# EAGLE schematic skematik jppi (EAGLE 9.6.2)
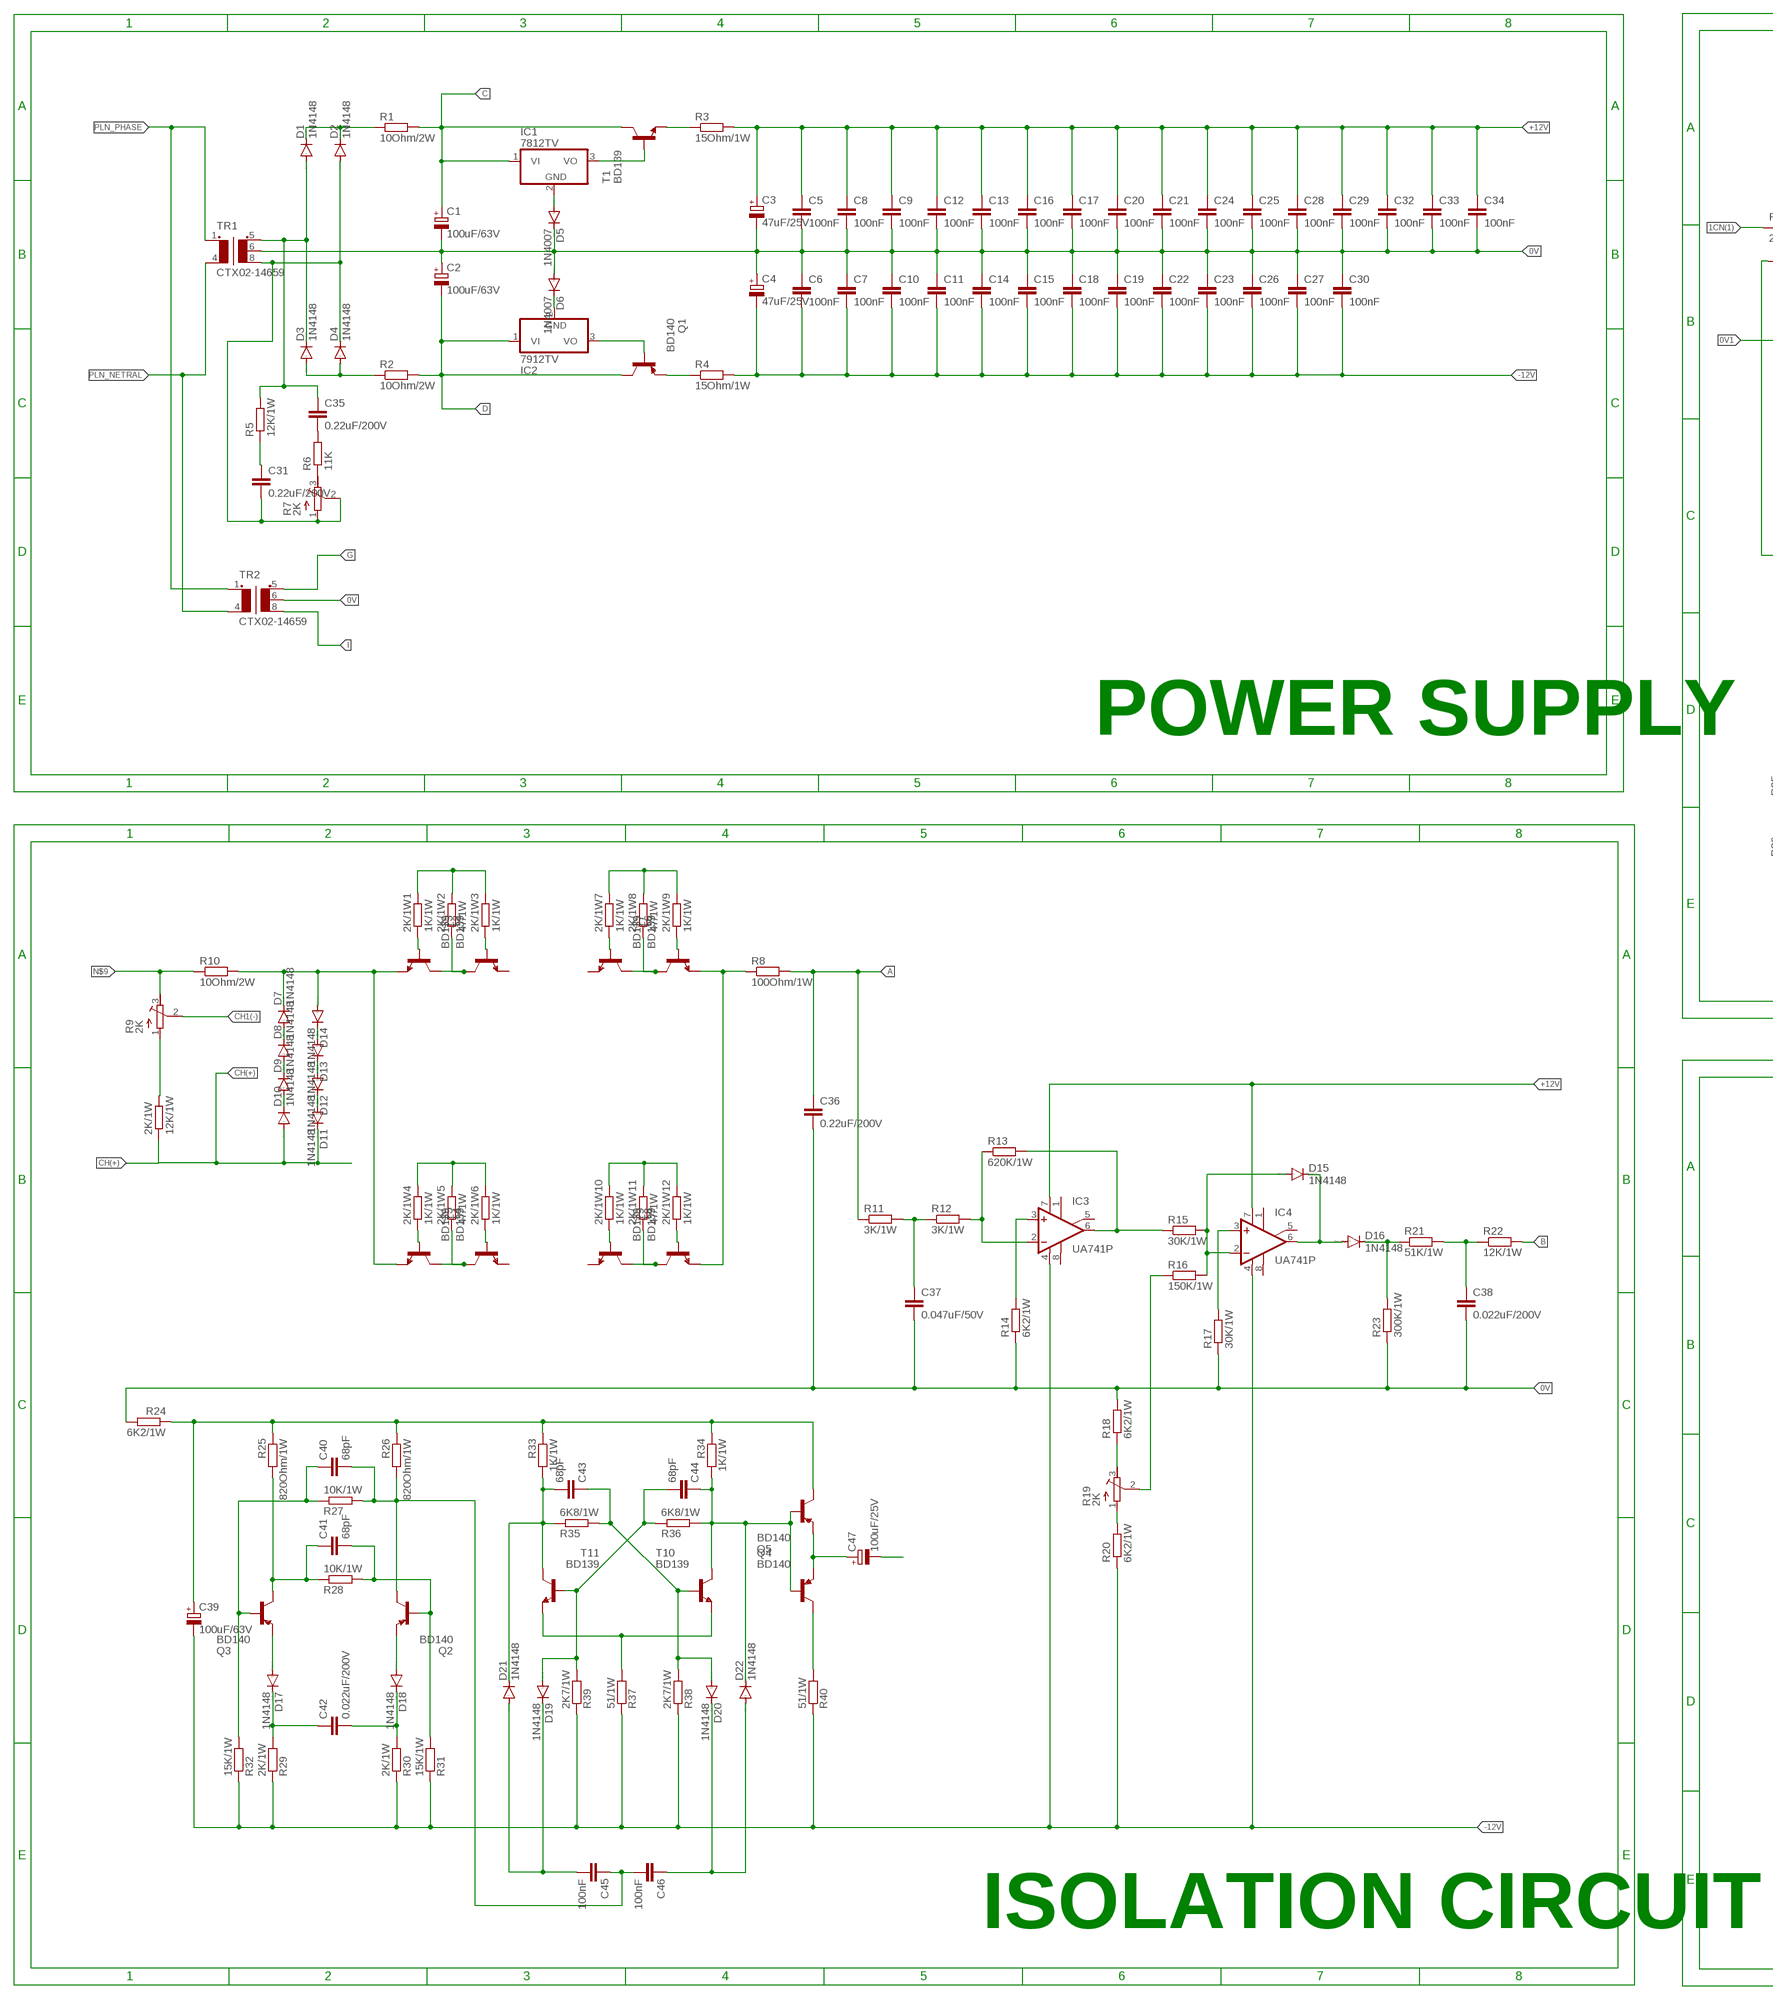
[diagram p0: schematic, sheet 1, part 1 of 3]
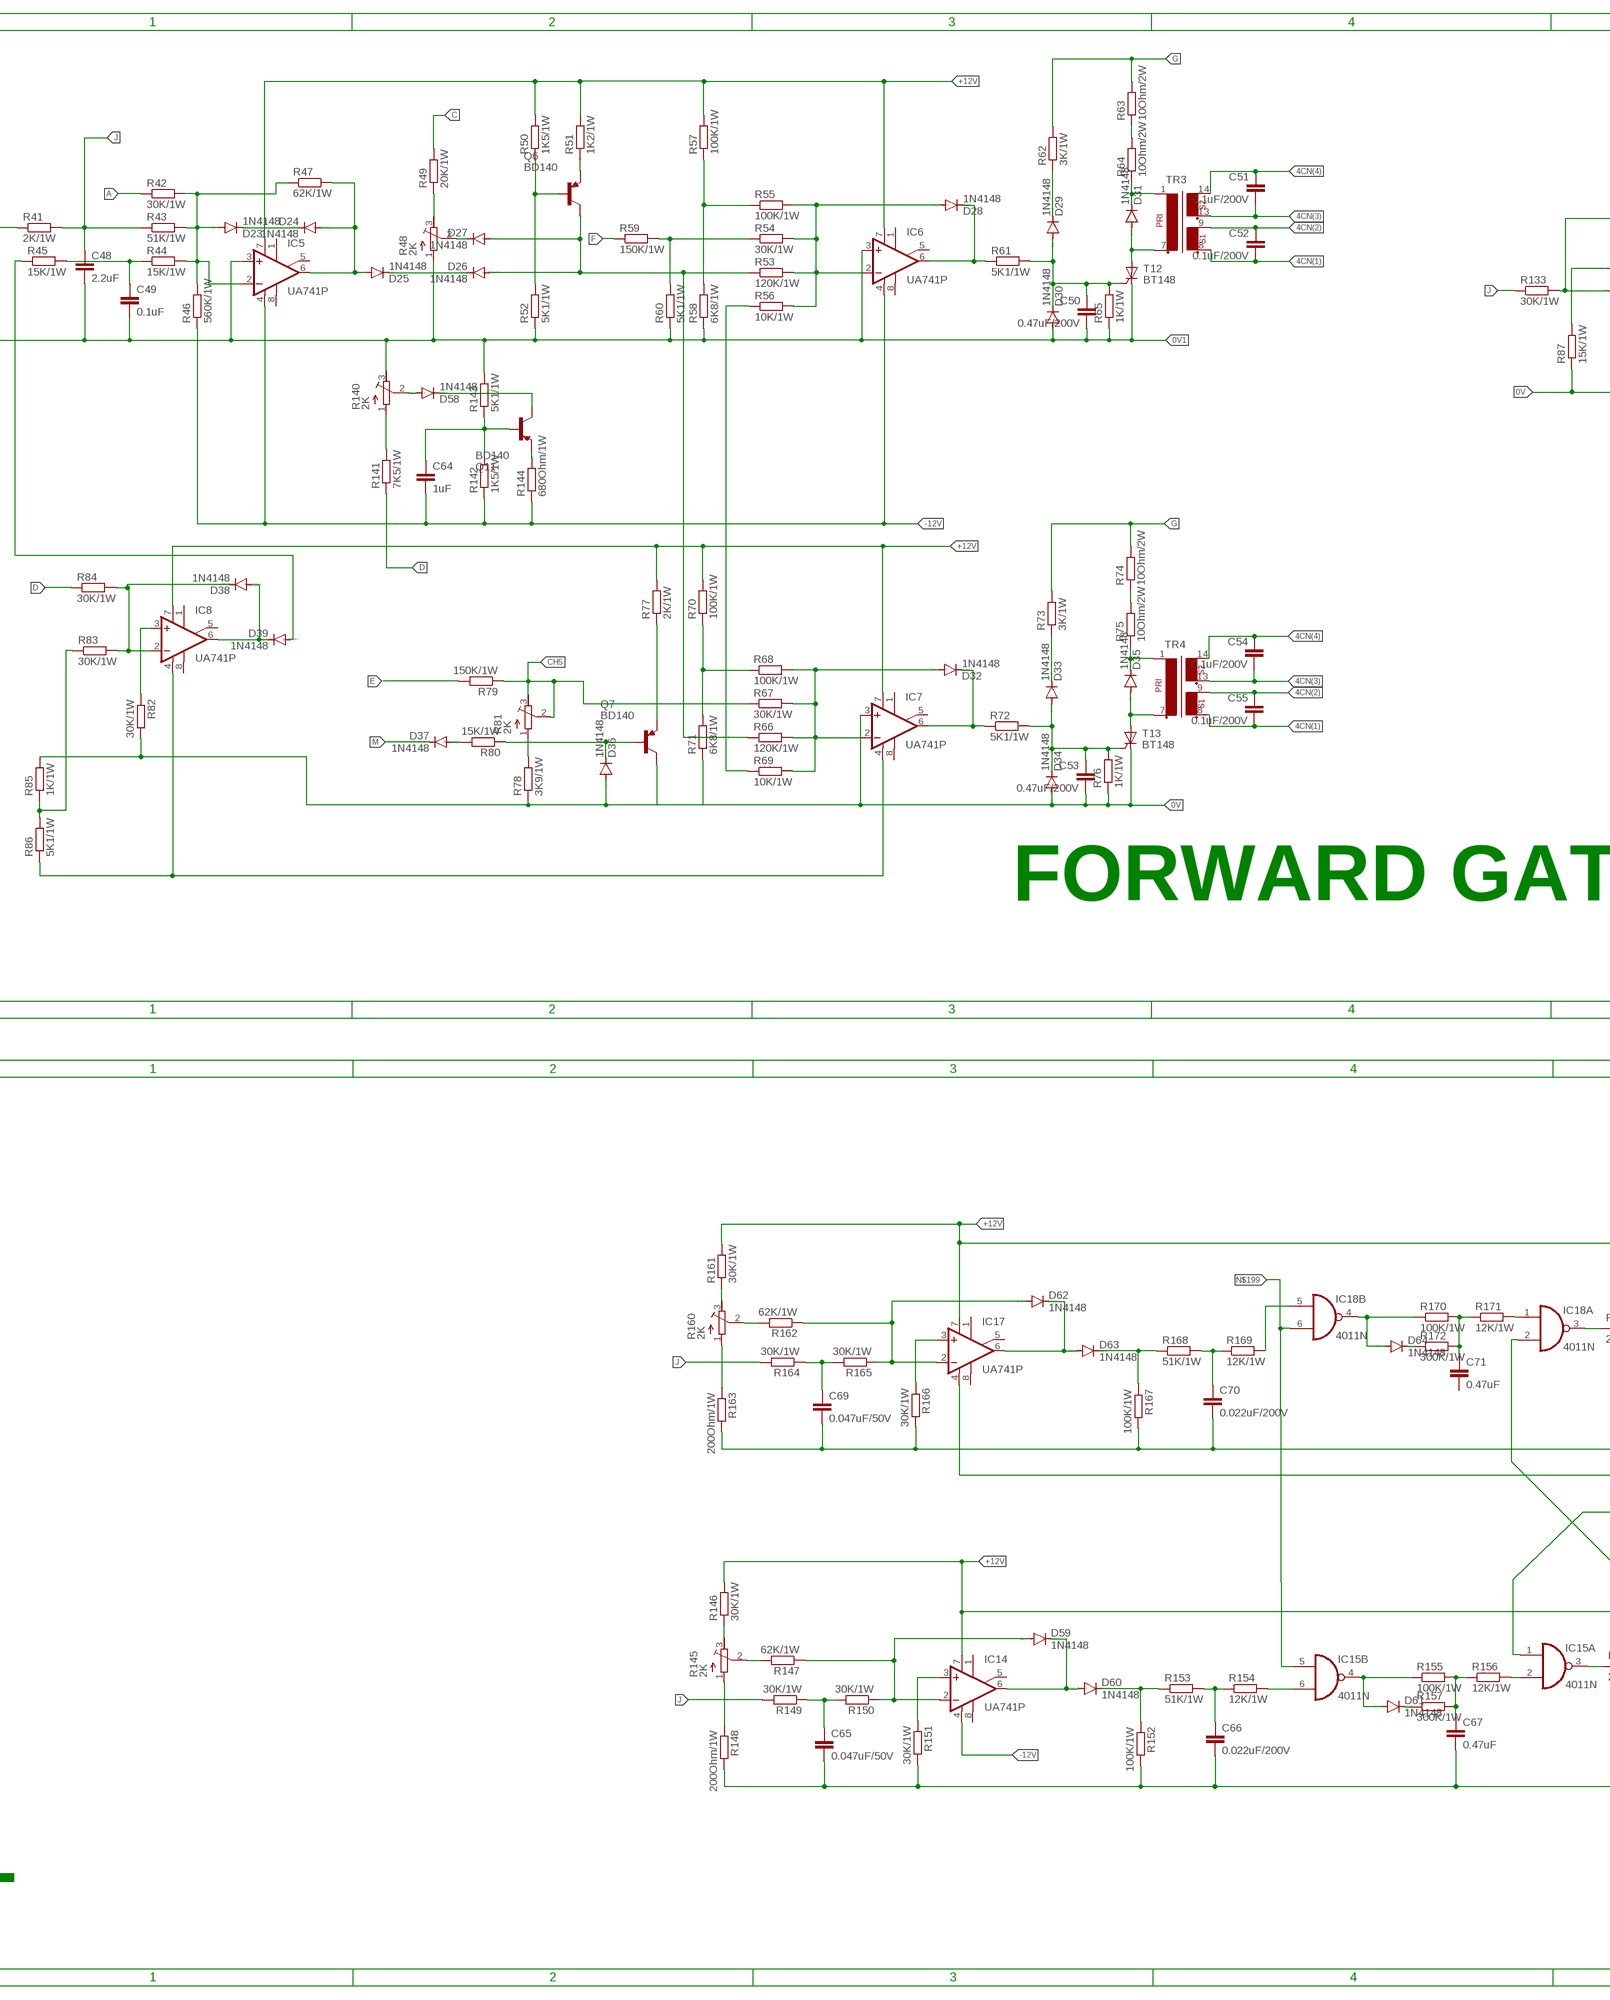
[diagram p1: schematic, sheet 1, part 2 of 3]
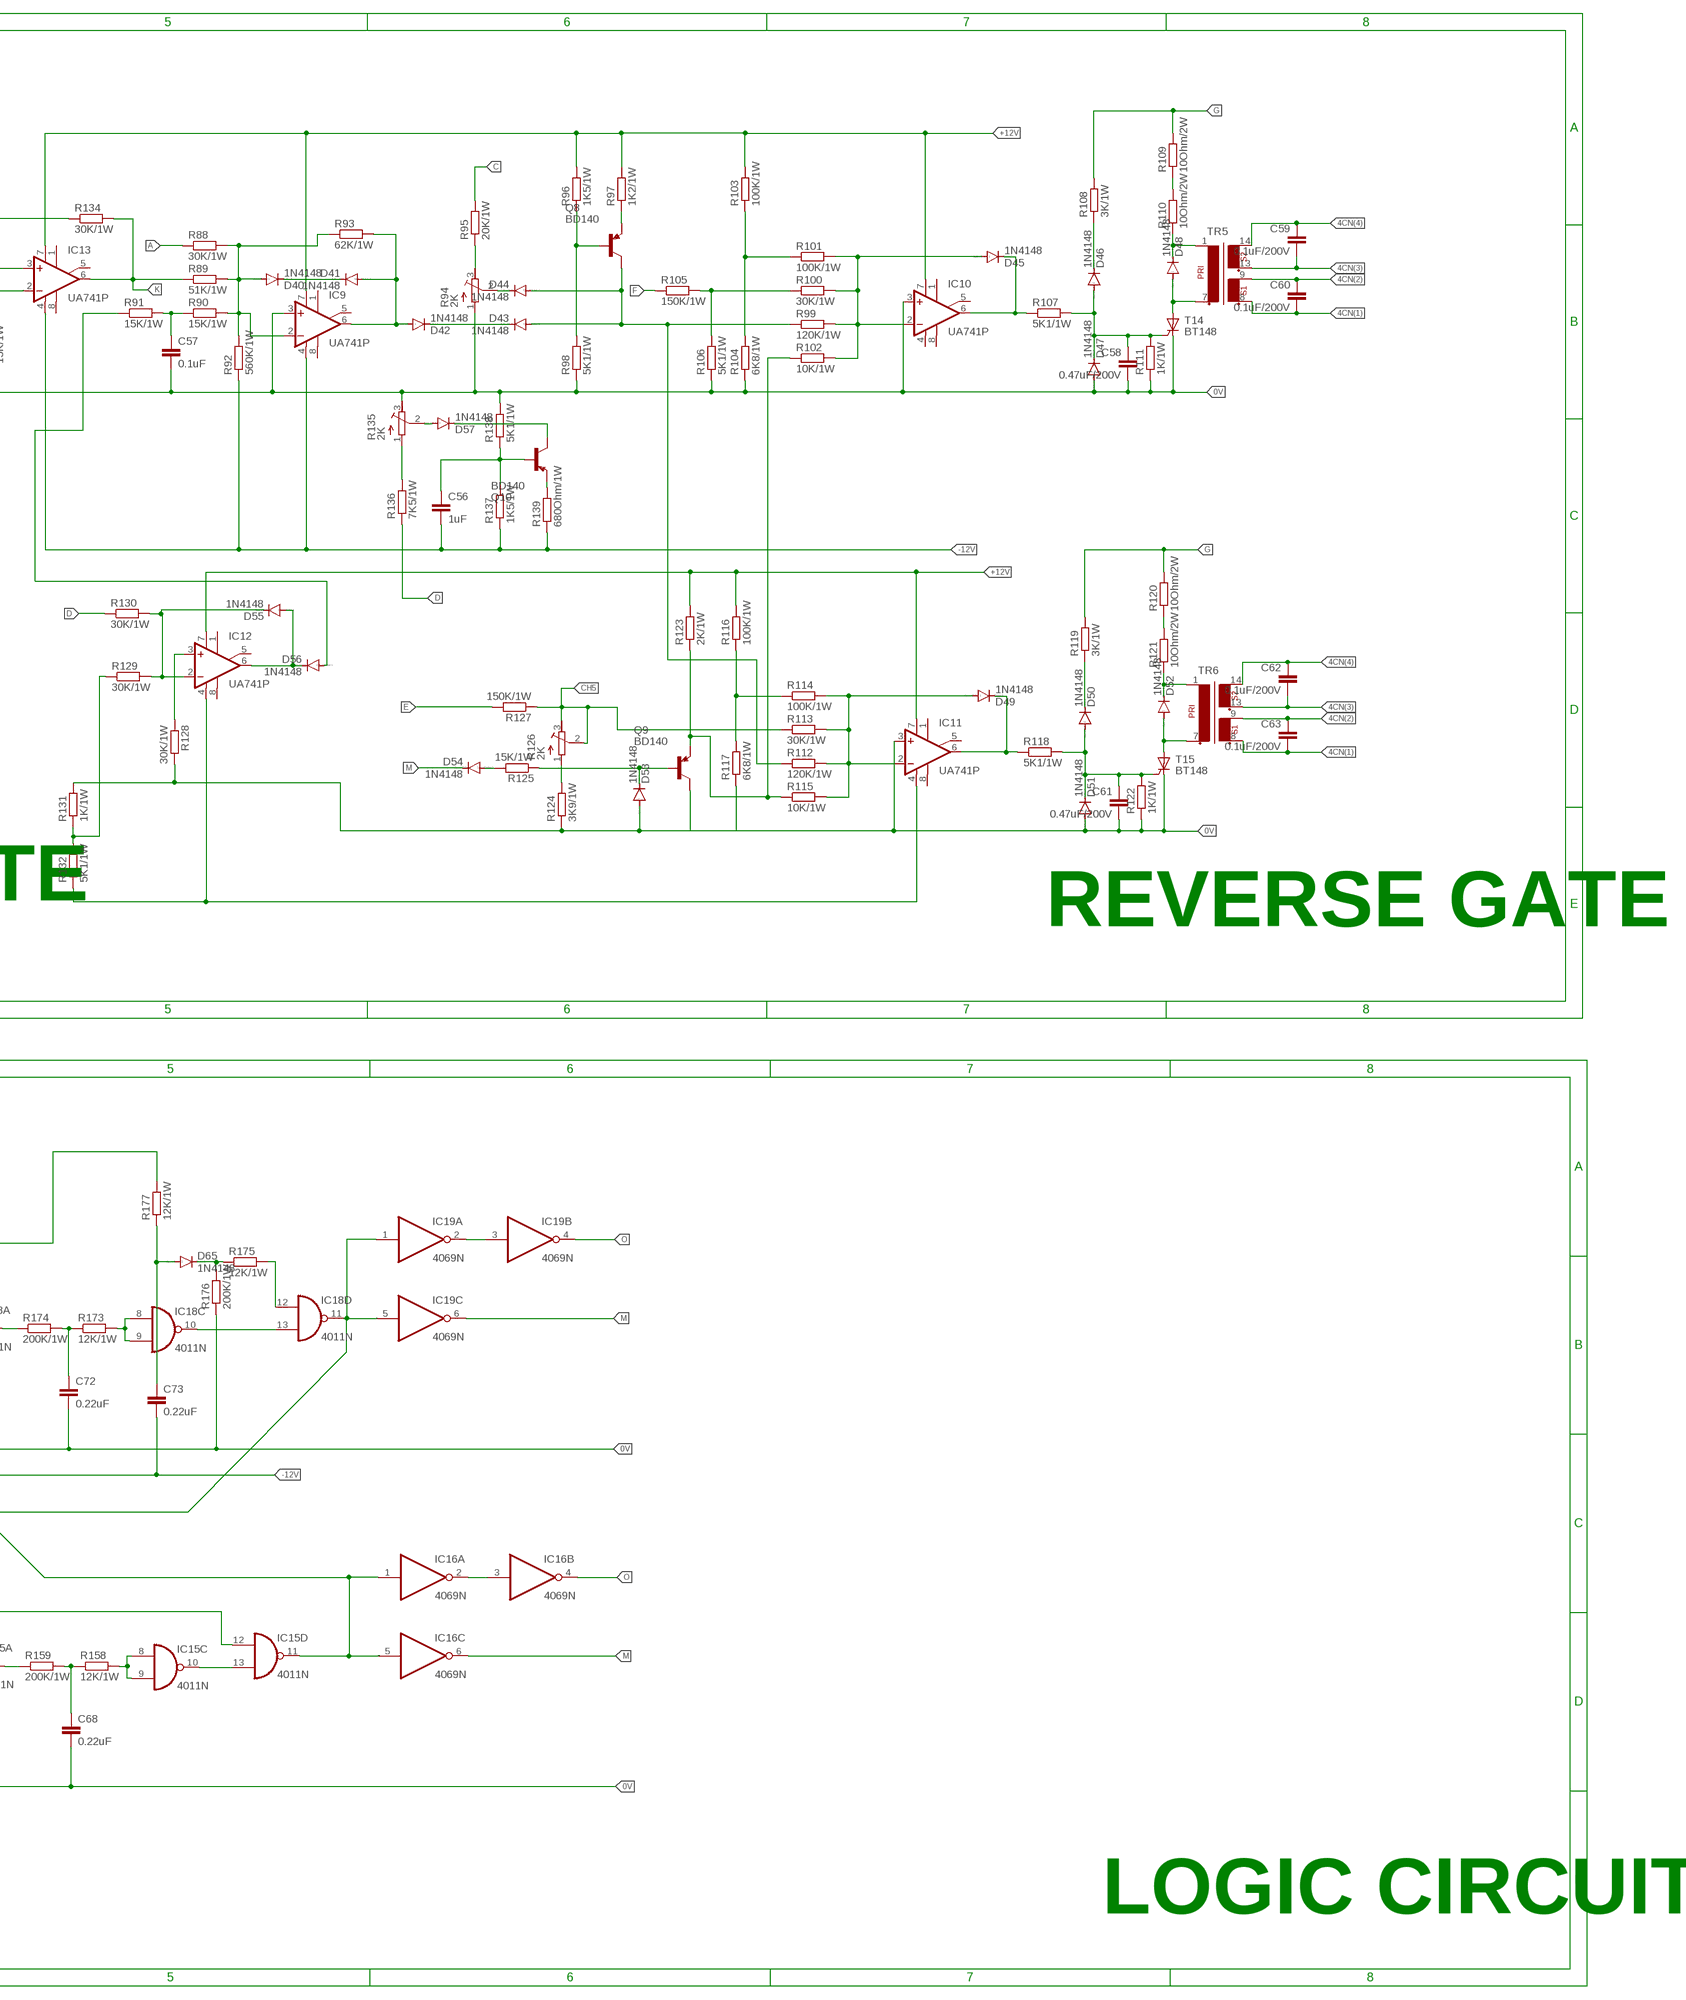
[diagram p2: schematic, sheet 1, part 3 of 3]

## Parts
2K/1W  12K/1W  R-EU_0309/12  [0309/12]
2K/1W1  1K/1W  R-EU_0309/12  [0309/12]
2K/1W2  47/1W  R-EU_0309/12  [0309/12]
2K/1W3  1K/1W  R-EU_0309/12  [0309/12]
2K/1W4  1K/1W  R-EU_0309/12  [0309/12]
2K/1W5  47/1W  R-EU_0309/12  [0309/12]
2K/1W6  1K/1W  R-EU_0309/12  [0309/12]
2K/1W7  1K/1W  R-EU_0309/12  [0309/12]
2K/1W8  47/1W  R-EU_0309/12  [0309/12]
2K/1W9  1K/1W  R-EU_0309/12  [0309/12]
2K/1W10  1K/1W  R-EU_0309/12  [0309/12]
2K/1W11  47/1W  R-EU_0309/12  [0309/12]
2K/1W12  1K/1W  R-EU_0309/12  [0309/12]
C1  100uF/63V  CPOL-EUE5-10.5  [E5-10,5]
C2  100uF/63V  CPOL-EUE5-10.5  [E5-10,5]
C3  47uF/25V  CPOL-EUE5-10.5  [E5-10,5]
C4  47uF/25V  CPOL-EUE5-10.5  [E5-10,5]
C5  100nF  C-EU050-025X075  [C050-025X075]
C6  100nF  C-EU050-025X075  [C050-025X075]
C7  100nF  C-EU050-025X075  [C050-025X075]
C8  100nF  C-EU050-025X075  [C050-025X075]
C9  100nF  C-EU050-025X075  [C050-025X075]
C10  100nF  C-EU050-025X075  [C050-025X075]
C11  100nF  C-EU050-025X075  [C050-025X075]
C12  100nF  C-EU050-025X075  [C050-025X075]
C13  100nF  C-EU050-025X075  [C050-025X075]
C14  100nF  C-EU050-025X075  [C050-025X075]
C15  100nF  C-EU050-025X075  [C050-025X075]
C16  100nF  C-EU050-025X075  [C050-025X075]
C17  100nF  C-EU050-025X075  [C050-025X075]
C18  100nF  C-EU050-025X075  [C050-025X075]
C19  100nF  C-EU050-025X075  [C050-025X075]
C20  100nF  C-EU050-025X075  [C050-025X075]
C21  100nF  C-EU050-025X075  [C050-025X075]
C22  100nF  C-EU050-025X075  [C050-025X075]
C23  100nF  C-EU050-025X075  [C050-025X075]
C24  100nF  C-EU050-025X075  [C050-025X075]
C25  100nF  C-EU050-025X075  [C050-025X075]
C26  100nF  C-EU050-025X075  [C050-025X075]
C27  100nF  C-EU050-025X075  [C050-025X075]
C28  100nF  C-EU050-025X075  [C050-025X075]
C29  100nF  C-EU050-025X075  [C050-025X075]
C30  100nF  C-EU050-025X075  [C050-025X075]
C31  0.22uF/200V  C-EU102-043X133  [C102-043X133]
C32  100nF  C-EU050-025X075  [C050-025X075]
C33  100nF  C-EU050-025X075  [C050-025X075]
C34  100nF  C-EU050-025X075  [C050-025X075]
C35  0.22uF/200V  C-EU102-043X133  [C102-043X133]
C36  0.22uF/200V  C-EU102-043X133  [C102-043X133]
C37  0.047uF/50V  C-EU075-032X103  [C075-032X103]
C38  0.022uF/200V  C-EU102-043X133  [C102-043X133]
C39  100uF/63V  CPOL-EUE5-10.5  [E5-10,5]
C40  68pF  C-EU050-024X044  [C050-024X044]
C41  68pF  C-EU050-024X044  [C050-024X044]
C42  0.022uF/200V  C-EU102-043X133  [C102-043X133]
C43  68pF  C-EU050-024X044  [C050-024X044]
C44  68pF  C-EU050-024X044  [C050-024X044]
C45  100nF  C-EU050-025X075  [C050-025X075]
C46  100nF  C-EU050-025X075  [C050-025X075]
C47  100uF/25V  CPOL-EUE5-10.5  [E5-10,5]
C48  2.2uF  C-EU050-025X075  [C050-025X075]
C49  0.1uF  C-EU050-025X075  [C050-025X075]
C50  0.47uF/200V  C-EU102-043X133  [C102-043X133]
C51  0.1uF/200V  C-EU102-043X133  [C102-043X133]
C52  0.1uF/200V  C-EU102-043X133  [C102-043X133]
C53  0.47uF/200V  C-EU102-043X133  [C102-043X133]
C54  0.1uF/200V  C-EU102-043X133  [C102-043X133]
C55  0.1uF/200V  C-EU102-043X133  [C102-043X133]
C56  1uF  C-EU050-025X075  [C050-025X075]
C57  0.1uF  C-EU050-025X075  [C050-025X075]
C58  0.47uF/200V  C-EU102-043X133  [C102-043X133]
C59  0.1uF/200V  C-EU102-043X133  [C102-043X133]
C60  0.1uF/200V  C-EU102-043X133  [C102-043X133]
C61  0.47uF/200V  C-EU102-043X133  [C102-043X133]
C62  0.1uF/200V  C-EU102-043X133  [C102-043X133]
C63  0.1uF/200V  C-EU102-043X133  [C102-043X133]
C64  1uF  C-EU050-025X075  [C050-025X075]
C65  0.047uF/50V  C-EU102-043X133  [C102-043X133]
C66  0.022uF/200V  C-EU102-043X133  [C102-043X133]
C67  0.47uF  C-EU102-043X133  [C102-043X133]
C68  0.22uF  C-EU102-043X133  [C102-043X133]
C69  0.047uF/50V  C-EU102-043X133  [C102-043X133]
C70  0.022uF/200V  C-EU102-043X133  [C102-043X133]
C71  0.47uF  C-EU102-043X133  [C102-043X133]
C72  0.22uF  C-EU102-043X133  [C102-043X133]
C73  0.22uF  C-EU102-043X133  [C102-043X133]
D1  1N4148  1N4004  [DO41-10]
D2  1N4148  1N4004  [DO41-10]
D3  1N4148  1N4004  [DO41-10]
D4  1N4148  1N4004  [DO41-10]
D5  1N4007  1N4004  [DO41-10]
D6  1N4007  1N4004  [DO41-10]
D7  1N4148  1N4004  [DO41-10]
D8  1N4148  1N4004  [DO41-10]
D9  1N4148  1N4004  [DO41-10]
D10  1N4148  1N4004  [DO41-10]
D11  1N4148  1N4004  [DO41-10]
D12  1N4148  1N4004  [DO41-10]
D13  1N4148  1N4004  [DO41-10]
D14  1N4148  1N4004  [DO41-10]
D15  1N4148  1N4004  [DO41-10]
D16  1N4148  1N4004  [DO41-10]
D17  1N4148  1N4004  [DO41-10]
D18  1N4148  1N4004  [DO41-10]
D19  1N4148  1N4004  [DO41-10]
D20  1N4148  1N4004  [DO41-10]
D21  1N4148  1N4004  [DO41-10]
D22  1N4148  1N4004  [DO41-10]
D23  1N4148  1N4004  [DO41-10]
D24  1N4148  1N4004  [DO41-10]
D25  1N4148  1N4004  [DO41-10]
D26  1N4148  1N4004  [DO41-10]
D27  1N4148  1N4004  [DO41-10]
D28  1N4148  1N4004  [DO41-10]
D29  1N4148  1N4004  [DO41-10]
D30  1N4148  1N4004  [DO41-10]
D31  1N4148  1N4004  [DO41-10]
D32  1N4148  1N4004  [DO41-10]
D33  1N4148  1N4004  [DO41-10]
D34  1N4148  1N4004  [DO41-10]
D35  1N4148  1N4004  [DO41-10]
D36  1N4148  1N4004  [DO41-10]
D37  1N4148  1N4004  [DO41-10]
D38  1N4148  1N4004  [DO41-10]
D39  1N4148  1N4004  [DO41-10]
D40  1N4148  1N4004  [DO41-10]
D41  1N4148  1N4004  [DO41-10]
D42  1N4148  1N4004  [DO41-10]
D43  1N4148  1N4004  [DO41-10]
D44  1N4148  1N4004  [DO41-10]
D45  1N4148  1N4004  [DO41-10]
D46  1N4148  1N4004  [DO41-10]
D47  1N4148  1N4004  [DO41-10]
D48  1N4148  1N4004  [DO41-10]
D49  1N4148  1N4004  [DO41-10]
D50  1N4148  1N4004  [DO41-10]
D51  1N4148  1N4004  [DO41-10]
D52  1N4148  1N4004  [DO41-10]
D53  1N4148  1N4004  [DO41-10]
D54  1N4148  1N4004  [DO41-10]
D55  1N4148  1N4004  [DO41-10]
D56  1N4148  1N4004  [DO41-10]
D57  1N4148  1N4004  [DO41-10]
D58  1N4148  1N4004  [DO41-10]
D59  1N4148  1N4004  [DO41-10]
D60  1N4148  1N4004  [DO41-10]
D61  1N4148  1N4004  [DO41-10]
D62  1N4148  1N4004  [DO41-10]
D63  1N4148  1N4004  [DO41-10]
D64  1N4148  1N4004  [DO41-10]
D65  1N4148  1N4004  [DO41-10]
IC1  7812TV  [TO220V]
IC2  7912TV  7812TV  [TO220V]
IC3  UA741P  [DIL08]
IC4  UA741P  [DIL08]
IC5  UA741P  [DIL08]
IC6  UA741P  [DIL08]
IC7  UA741P  [DIL08]
IC8  UA741P  [DIL08]
IC9  UA741P  [DIL08]
IC10  UA741P  [DIL08]
IC11  UA741P  [DIL08]
IC12  UA741P  [DIL08]
IC13  UA741P  [DIL08]
IC14  UA741P  [DIL08]
IC15  4011N  [DIL14]
IC16  4069N  [DIL14]
IC17  UA741P  [DIL08]
IC18  4011N  [DIL14]
IC19  4069N  [DIL14]
Q1  BD140  [TO126]
Q2  BD140  [TO126]
Q3  BD140  [TO126]
Q4  BD140  [TO126]
Q5  BD140  [TO126]
Q6  BD140  [TO126]
Q7  BD140  [TO126]
Q8  BD140  [TO126]
Q9  BD140  [TO126]
Q10  BD140  [TO126]
Q11  BD140  [TO126]
R1  10Ohm/2W  R-EU_0411/15  [0411/15]
R2  10Ohm/2W  R-EU_0411/15  [0411/15]
R3  15Ohm/1W  R-EU_0309/12  [0309/12]
R4  15Ohm/1W  R-EU_0309/12  [0309/12]
R5  12K/1W  R-EU_0309/12  [0309/12]
R6  11K  R-EU_0309/12  [0309/12]
R7  2K  R-TRIMM3339P  [RTRIM3339P]
R8  100Ohm/1W  R-EU_0411/15  [0411/15]
R9  2K  R-TRIMM3339P  [RTRIM3339P]
R10  10Ohm/2W  R-EU_0411/15  [0411/15]
R11  3K/1W  R-EU_0411/15  [0411/15]
R12  3K/1W  R-EU_0411/15  [0411/15]
R13  620K/1W  R-EU_0411/15  [0411/15]
R14  6K2/1W  R-EU_0411/15  [0411/15]
R15  30K/1W  R-EU_0411/15  [0411/15]
R16  150K/1W  R-EU_0411/15  [0411/15]
R17  30K/1W  R-EU_0411/15  [0411/15]
R18  6K2/1W  R-EU_0411/15  [0411/15]
R19  2K  R-TRIMM3339P  [RTRIM3339P]
R20  6K2/1W  R-EU_0411/15  [0411/15]
R21  51K/1W  R-EU_0411/15  [0411/15]
R22  12K/1W  R-EU_0411/15  [0411/15]
R23  300K/1W  R-EU_0411/15  [0411/15]
R24  6K2/1W  R-EU_0411/15  [0411/15]
R25  820Ohm/1W  R-EU_0411/15  [0411/15]
R26  820Ohm/1W  R-EU_0411/15  [0411/15]
R27  10K/1W  R-EU_0411/15  [0411/15]
R28  10K/1W  R-EU_0411/15  [0411/15]
R29  2K/1W  R-EU_0411/15  [0411/15]
R30  2K/1W  R-EU_0411/15  [0411/15]
R31  15K/1W  R-EU_0411/15  [0411/15]
R32  15K/1W  R-EU_0411/15  [0411/15]
R33  1K/1W  R-EU_0411/15  [0411/15]
R34  1K/1W  R-EU_0411/15  [0411/15]
R35  6K8/1W  R-EU_0411/15  [0411/15]
R36  6K8/1W  R-EU_0411/15  [0411/15]
R37  51/1W  R-EU_0411/15  [0411/15]
R38  2K7/1W  R-EU_0411/15  [0411/15]
R39  2K7/1W  R-EU_0411/15  [0411/15]
R40  51/1W  R-EU_0411/15  [0411/15]
R41  2K/1W  R-EU_0411/15  [0411/15]
R42  30K/1W  R-EU_0411/15  [0411/15]
R43  51K/1W  R-EU_0411/15  [0411/15]
R44  15K/1W  R-EU_0411/15  [0411/15]
R45  15K/1W  R-EU_0411/15  [0411/15]
R46  560K/1W  R-EU_0411/15  [0411/15]
R47  62K/1W  R-EU_0411/15  [0411/15]
R48  2K  R-TRIMM3339P  [RTRIM3339P]
R49  20K/1W  R-EU_0411/15  [0411/15]
R50  1K5/1W  R-EU_0411/15  [0411/15]
R51  1K2/1W  R-EU_0411/15  [0411/15]
R52  5K1/1W  R-EU_0411/15  [0411/15]
R53  120K/1W  R-EU_0411/15  [0411/15]
R54  30K/1W  R-EU_0411/15  [0411/15]
R55  100K/1W  R-EU_0411/15  [0411/15]
R56  10K/1W  R-EU_0411/15  [0411/15]
R57  100K/1W  R-EU_0411/15  [0411/15]
R58  6K8/1W  R-EU_0411/15  [0411/15]
R59  150K/1W  R-EU_0411/15  [0411/15]
R60  5K1/1W  R-EU_0411/15  [0411/15]
R61  5K1/1W  R-EU_0411/15  [0411/15]
R62  3K/1W  R-EU_0411/15  [0411/15]
R63  10Ohm/2W  R-EU_0411/15  [0411/15]
R64  10Ohm/2W  R-EU_0411/15  [0411/15]
R65  1K/1W  R-EU_0411/15  [0411/15]
R66  120K/1W  R-EU_0411/15  [0411/15]
R67  30K/1W  R-EU_0411/15  [0411/15]
R68  100K/1W  R-EU_0411/15  [0411/15]
R69  10K/1W  R-EU_0411/15  [0411/15]
R70  100K/1W  R-EU_0411/15  [0411/15]
R71  6K8/1W  R-EU_0411/15  [0411/15]
R72  5K1/1W  R-EU_0411/15  [0411/15]
R73  3K/1W  R-EU_0411/15  [0411/15]
R74  10Ohm/2W  R-EU_0411/15  [0411/15]
R75  10Ohm/2W  R-EU_0411/15  [0411/15]
R76  1K/1W  R-EU_0411/15  [0411/15]
R77  2K/1W  R-EU_0411/15  [0411/15]
R78  3K9/1W  R-EU_0411/15  [0411/15]
R79  150K/1W  R-EU_0411/15  [0411/15]
R80  15K/1W  R-EU_0411/15  [0411/15]
R81  2K  R-TRIMM3339P  [RTRIM3339P]
R82  30K/1W  R-EU_0411/15  [0411/15]
R83  30K/1W  R-EU_0411/15  [0411/15]
R84  30K/1W  R-EU_0411/15  [0411/15]
R85  1K/1W  R-EU_0411/15  [0411/15]
R86  5K1/1W  R-EU_0411/15  [0411/15]
R87  15K/1W  R-EU_0411/15  [0411/15]
R88  30K/1W  R-EU_0411/15  [0411/15]
R89  51K/1W  R-EU_0411/15  [0411/15]
R90  15K/1W  R-EU_0411/15  [0411/15]
R91  15K/1W  R-EU_0411/15  [0411/15]
R92  560K/1W  R-EU_0411/15  [0411/15]
R93  62K/1W  R-EU_0411/15  [0411/15]
R94  2K  R-TRIMM3339P  [RTRIM3339P]
R95  20K/1W  R-EU_0411/15  [0411/15]
R96  1K5/1W  R-EU_0411/15  [0411/15]
R97  1K2/1W  R-EU_0411/15  [0411/15]
R98  5K1/1W  R-EU_0411/15  [0411/15]
R99  120K/1W  R-EU_0411/15  [0411/15]
R100  30K/1W  R-EU_0411/15  [0411/15]
R101  100K/1W  R-EU_0411/15  [0411/15]
R102  10K/1W  R-EU_0411/15  [0411/15]
R103  100K/1W  R-EU_0411/15  [0411/15]
R104  6K8/1W  R-EU_0411/15  [0411/15]
R105  150K/1W  R-EU_0411/15  [0411/15]
R106  5K1/1W  R-EU_0411/15  [0411/15]
R107  5K1/1W  R-EU_0411/15  [0411/15]
R108  3K/1W  R-EU_0411/15  [0411/15]
R109  10Ohm/2W  R-EU_0411/15  [0411/15]
R110  10Ohm/2W  R-EU_0411/15  [0411/15]
R111  1K/1W  R-EU_0411/15  [0411/15]
R112  120K/1W  R-EU_0411/15  [0411/15]
R113  30K/1W  R-EU_0411/15  [0411/15]
R114  100K/1W  R-EU_0411/15  [0411/15]
R115  10K/1W  R-EU_0411/15  [0411/15]
R116  100K/1W  R-EU_0411/15  [0411/15]
R117  6K8/1W  R-EU_0411/15  [0411/15]
R118  5K1/1W  R-EU_0411/15  [0411/15]
R119  3K/1W  R-EU_0411/15  [0411/15]
R120  10Ohm/2W  R-EU_0411/15  [0411/15]
R121  10Ohm/2W  R-EU_0411/15  [0411/15]
R122  1K/1W  R-EU_0411/15  [0411/15]
R123  2K/1W  R-EU_0411/15  [0411/15]
R124  3K9/1W  R-EU_0411/15  [0411/15]
R125  15K/1W  R-EU_0411/15  [0411/15]
R126  2K  R-TRIMM3339P  [RTRIM3339P]
R127  150K/1W  R-EU_0411/15  [0411/15]
R128  30K/1W  R-EU_0411/15  [0411/15]
R129  30K/1W  R-EU_0411/15  [0411/15]
R130  30K/1W  R-EU_0411/15  [0411/15]
R131  1K/1W  R-EU_0411/15  [0411/15]
R132  5K1/1W  R-EU_0411/15  [0411/15]
R133  30K/1W  R-EU_0411/15  [0411/15]
R134  30K/1W  R-EU_0411/15  [0411/15]
R135  2K  R-TRIMM3339P  [RTRIM3339P]
R136  7K5/1W  R-EU_0411/15  [0411/15]
R137  1K5/1W  R-EU_0411/15  [0411/15]
R138  5K1/1W  R-EU_0411/15  [0411/15]
R139  680Ohm/1W  R-EU_0411/15  [0411/15]
R140  2K  R-TRIMM3339P  [RTRIM3339P]
R141  7K5/1W  R-EU_0411/15  [0411/15]
R142  1K5/1W  R-EU_0411/15  [0411/15]
R143  5K1/1W  R-EU_0411/15  [0411/15]
R144  680Ohm/1W  R-EU_0411/15  [0411/15]
R145  2K  R-TRIMM3339P  [RTRIM3339P]
R146  30K/1W  R-EU_0411/15  [0411/15]
R147  62K/1W  R-EU_0411/15  [0411/15]
R148  200Ohm/1W  R-EU_0411/15  [0411/15]
R149  30K/1W  R-EU_0411/15  [0411/15]
R150  30K/1W  R-EU_0411/15  [0411/15]
R151  30K/1W  R-EU_0411/15  [0411/15]
R152  100K/1W  R-EU_0411/15  [0411/15]
R153  51K/1W  R-EU_0411/15  [0411/15]
R154  12K/1W  R-EU_0411/15  [0411/15]
R155  100K/1W  R-EU_0411/15  [0411/15]
R156  12K/1W  R-EU_0411/15  [0411/15]
R157  300K/1W  R-EU_0411/15  [0411/15]
R158  12K/1W  R-EU_0411/15  [0411/15]
R159  200K/1W  R-EU_0411/15  [0411/15]
R160  2K  R-TRIMM3339P  [RTRIM3339P]
R161  30K/1W  R-EU_0411/15  [0411/15]
R162  62K/1W  R-EU_0411/15  [0411/15]
R163  200Ohm/1W  R-EU_0411/15  [0411/15]
R164  30K/1W  R-EU_0411/15  [0411/15]
R165  30K/1W  R-EU_0411/15  [0411/15]
R166  30K/1W  R-EU_0411/15  [0411/15]
R167  100K/1W  R-EU_0411/15  [0411/15]
R168  51K/1W  R-EU_0411/15  [0411/15]
R169  12K/1W  R-EU_0411/15  [0411/15]
R170  100K/1W  R-EU_0411/15  [0411/15]
R171  12K/1W  R-EU_0411/15  [0411/15]
R172  300K/1W  R-EU_0411/15  [0411/15]
R173  12K/1W  R-EU_0411/15  [0411/15]
R174  200K/1W  R-EU_0411/15  [0411/15]
R175  12K/1W  R-EU_0411/15  [0411/15]
R176  200K/1W  R-EU_0411/15  [0411/15]
R177  12K/1W  R-EU_0411/15  [0411/15]
T1  BD139  [TO126]
T2  BD139  [TO126]
T3  BD139  [TO126]
T4  BD139  [TO126]
T5  BD139  [TO126]
T6  BD139  [TO126]
T7  BD139  [TO126]
T8  BD139  [TO126]
T9  BD139  [TO126]
T10  BD139  [TO126]
T11  BD139  [TO126]
T12  BT148  [SOT82S]
T13  BT148  [SOT82S]
T14  BT148  [SOT82S]
T15  BT148  [SOT82S]
TR1  CTX02-14659  [CTX02-14659]
TR2  CTX02-14659  [CTX02-14659]
TR3  EI54-2  [EI54-2]
TR4  EI54-2  [EI54-2]
TR5  EI54-2  [EI54-2]
TR6  EI54-2  [EI54-2]

## Nets
0V: C1.- C2.+ C3.- C4.+ C5.2 C6.1 C7.1 C8.2 C9.2 C10.1 C11.1 C12.2 C13.2 C14.1 C15.1 C16.2 C17.2 C18.1 C19.1 C20.2 C21.2 C22.1 C23.1 C24.2 C25.2 C26.1 C27.1 C28.2 C29.2 C30.1 C32.2 C33.2 C34.2 C36.2 C37.2 C38.2 C53.2 C57.2 C58.2 C61.2 C65.2 C66.2 C67.2 C68.2 C69.2 C70.2 C72.2 D5.C D6.A D34.A D36.A D47.A D51.A D53.A IC7.3(+IN) IC9.3(+IN) IC10.3(+IN) IC11.3(+IN) Q7.2(C) Q9.2(C) R14.1 R17.1 R18.2 R23.1 R24.2 R71.1 R76.1 R78.1 R82.2 R85.2 R87.1 R94.1(A) R98.1 R104.1 R106.1 R111.1 R117.1 R122.1 R124.1 R128.2 R131.2 R135.3(E) R138.2 R148.2 R151.2 R152.2 R163.2 R166.2 R167.2 R176.1 T13.C T14.C T15.C TR1.6 TR2.6
0V1: C48.2 C49.2 C50.2 D30.A IC5.3(+IN) IC6.3(+IN) R48.1(A) R52.1 R58.1 R60.1 R65.1 R140.3(E) R143.2 T12.C
1CN(1): R41.1
4CN(1): C52.2 C55.2 C60.2 C63.2 TR3.8 TR4.8 TR5.8 TR6.8
4CN(2): C52.1 C55.1 C60.1 C63.1 TR3.9 TR4.9 TR5.9 TR6.9
4CN(3): C51.2 C54.2 C59.2 C62.2 TR3.13 TR4.13 TR5.13 TR6.13
4CN(4): C51.1 C54.1 C59.1 C62.1 TR3.14 TR4.14 TR5.14 TR6.14
+12V: C3.+ C5.1 C8.1 C9.1 C12.1 C13.1 C16.1 C17.1 C20.1 C21.1 C24.1 C25.1 C28.1 C29.1 C32.1 C33.1 C34.1 IC3.7(V+) IC4.7(V+) IC5.7(V+) IC6.7(V+) IC7.7(V+) IC8.7(V+) IC9.7(V+) IC10.7(V+) IC11.7(V+) IC12.7(V+) IC13.7(V+) IC14.7(V+) IC15.12(D:I0) IC17.7(V+) R3.2 R50.2 R51.2 R57.2 R70.2 R77.2 R96.2 R97.2 R103.2 R116.2 R123.2 R146.2 R161.2 R177.2
-12V: C4.- C6.2 C7.2 C10.2 C11.2 C14.2 C15.2 C18.2 C19.2 C22.2 C23.2 C26.2 C27.2 C30.2 C39.- C56.2 C64.2 C73.2 IC3.4(V-) IC4.4(V-) IC5.4(V-) IC6.4(V-) IC9.4(V-) IC13.4(V-) IC14.4(V-) IC17.4(V-) R4.2 R20.1 R29.1 R30.1 R31.1 R32.1 R37.1 R38.1 R39.1 R40.1 R46.1 R92.1 R137.1 R139.1 R142.1 R144.1
A: C36.1 R8.2 R11.1 R42.1 R88.1
B: R22.2
C: C1.+ IC1.1(VI) R1.2 R49.2 R95.2 T1.2(C)
CH1(-): R9.2(S)
CH5: R67.1 R79.1 R81.2(S) R81.3(E) R113.1 R126.2(S) R126.3(E) R127.1
CH(+): 2K/1W.1 D10.A D11.C
D: C2.- IC2.1(VI) Q1.2(C) R2.2 R84.1 R130.1 R136.1 R141.1
E: R79.2 R127.2
F: R59.1 R105.1
G: R62.2 R63.2 R73.2 R74.2 R108.2 R109.2 R119.2 R120.2 TR2.5
I: TR2.8
J: C48.1 R41.2 R43.1 R133.1 R149.2 R164.2
K: IC13.6(OUT) R89.1 R134.2
M: D37.C D54.C IC16.6(C:O) IC19.6(C:O)
N$1: C35.1 D1.A D3.C R5.2 TR1.5
N$2: C31.2 D2.A D4.C R7.1(A) R7.2(S) TR1.8
N$3: D1.C D2.C R1.1
N$4: D3.A D4.A R2.1
N$5: R6.1 R7.3(E)
N$6: C31.1 R5.1
N$7: 2K/1W.2 R9.1(A)
N$8: D6.C IC2.2(GND)
N$9: R9.3(E) R10.1
N$10: D5.A IC1.2(GND)
N$11: IC1.3(VO) T1.3(B)
N$12: IC2.3(VO) Q1.3(B)
N$13: Q1.1(E) R4.1
N$14: R3.1 T1.1(E)
N$15: D7.A D8.C
N$16: D7.C D14.A R10.2 T2.1(E) T4.1(E)
N$17: 2K/1W2.1 T2.2(C) T3.2(C)
N$18: C35.2 R6.2
N$19: D8.A D9.C
N$20: D9.A D10.C
N$21: D11.A D12.C
N$22: D12.A D13.C
N$23: D13.A D14.C
N$24: 2K/1W1.1 T2.3(B)
N$25: 2K/1W3.1 T3.3(B)
N$26: 2K/1W1.2 2K/1W2.2 2K/1W3.2
N$27: 2K/1W5.1 T4.2(C) T5.2(C)
N$28: 2K/1W4.1 T4.3(B)
N$29: 2K/1W6.1 T5.3(B)
N$30: 2K/1W4.2 2K/1W5.2 2K/1W6.2
N$31: 2K/1W8.1 T6.2(C) T7.2(C)
N$32: 2K/1W7.1 T6.3(B)
N$33: 2K/1W9.1 T7.3(B)
N$34: 2K/1W7.2 2K/1W8.2 2K/1W9.2
N$35: 2K/1W11.1 T8.2(C) T9.2(C)
N$36: 2K/1W10.1 T8.3(B)
N$37: 2K/1W12.1 T9.3(B)
N$38: 2K/1W10.2 2K/1W11.2 2K/1W12.2
N$39: R8.1 T7.1(E) T9.1(E)
N$40: R63.1 R64.2
N$41: R19.1(A) R20.2
N$42: C37.1 R11.2 R12.1
N$43: IC3.2(-IN) R12.2 R13.1
N$44: IC3.6(OUT) R13.2 R15.1
N$45: IC3.3(+IN) R14.2
N$46: IC4.3(+IN) R17.2
N$47: R18.1 R19.3(E)
N$48: R16.1 R19.2(S)
N$49: D15.C D16.A IC4.6(OUT)
N$50: C39.+ Q5.2(C) R24.1 R25.1 R26.1 R33.1 R34.1
N$51: D16.C R21.1 R23.2
N$52: C38.1 R21.2 R22.1
N$53: C41.1 Q3.2(C) R25.2 R28.1
N$54: C47.+ Q4.1(E) Q5.1(E)
N$55: C41.2 Q2.3(B) R28.2 R31.2
N$56: C40.1 Q3.3(B) R27.1 R32.2
N$57: D17.A Q3.1(E)
N$58: D18.A Q2.1(E)
N$59: C42.1 D17.C R29.2
N$60: C42.2 D18.C R30.2
N$61: C43.2 D21.C R33.2 R35.1 T11.2(C)
N$62: C40.2 C45.1 C46.2 Q2.2(C) R26.2 R27.2
N$63: C43.1 D20.A R35.2 R38.2 T10.3(B)
N$64: C44.2 D19.A R36.1 R39.2 T11.3(B)
N$65: R37.2 T10.1(E) T11.1(E)
N$66: C46.1 D20.C D22.A
N$67: C44.1 D22.C Q4.3(B) Q5.3(B) R34.2 R36.2 T10.2(C)
N$68: C45.2 D19.C D21.A
N$69: D23.A IC5.2(-IN) R42.2 R43.2 R44.2 R46.2 R47.1
N$70: Q4.2(C) R40.2
N$71: C47.-
N$72: C49.1 R44.1 R45.2
N$73: R56.1 R69.1
N$74: D15.A IC4.2(-IN) R15.2 R16.2
N$75: D24.A D25.A IC5.6(OUT) R47.2
N$76: D25.C D26.C
N$77: D23.C D24.C
N$78: D27.C R48.2(S)
N$79: R48.3(E) R49.1
N$80: Q6.1(E) R51.1
N$81: Q6.3(B) R50.1 R52.2
N$82: D26.A D27.A Q6.2(C) R53.1 R66.1
N$83: D28.A IC6.2(-IN) R53.2 R54.2 R55.2 R56.2
N$84: R55.1 R57.1 R58.2
N$85: R54.1 R59.2 R60.2
N$86: D28.C IC6.6(OUT) R61.1
N$87: C50.1 D29.A D30.C R61.2 R65.2 T12.G
N$88: D29.C R62.1
N$89: D31.C R64.1 TR3.1
N$90: D31.A T12.A TR3.7
N$91: D32.A IC7.2(-IN) R66.2 R67.2 R68.2 R69.2
N$92: R68.1 R70.1 R71.2
N$93: R78.2 R81.1(A)
N$94: D32.C IC7.6(OUT) R72.1
N$95: C53.1 D33.A D34.C R72.2 R76.2 T13.G
N$96: D33.C R73.1
N$97: R74.1 R75.2
N$98: D35.C R75.1 TR4.1
N$99: D35.A T13.A TR4.7
N$100: Q7.1(E) R77.1
N$101: D36.C Q7.3(B) R80.1
N$102: IC7.4(V-) IC8.4(V-) R86.1
N$103: R83.1 R85.1 R86.2
N$104: D37.A R80.2
N$105: D38.A D39.C IC8.6(OUT)
N$106: IC8.3(+IN) R82.1
N$107: D38.C IC8.2(-IN) R83.2 R84.2
N$108: D39.A R45.1
N$109: D40.A IC9.2(-IN) R88.2 R89.2 R90.2 R92.2 R93.1
N$110: C57.1 R90.1 R91.2
N$111: D41.A D42.A IC9.6(OUT) R93.2
N$112: D40.C D41.C
N$113: D42.C D43.C
N$114: D44.C R94.2(S)
N$115: R94.3(E) R95.1
N$116: Q8.1(E) R97.1
N$117: Q8.3(B) R96.1 R98.2
N$118: D43.A D44.A Q8.2(C) R99.1 R112.1
N$119: D45.A IC10.2(-IN) R99.2 R100.2 R101.2 R102.2
N$120: R101.1 R103.1 R104.2
N$121: R100.1 R105.2 R106.2
N$122: D45.C IC10.6(OUT) R107.1
N$123: C58.1 D46.A D47.C R107.2 R111.2 T14.G
N$124: D46.C R108.1
N$125: R109.1 R110.2
N$126: D48.C R110.1 TR5.1
N$127: D48.A T14.A TR5.7
N$128: D57.C Q10.2(C)
N$129: C56.1 Q10.3(B) R137.2 R138.1
N$130: D49.A IC11.2(-IN) R112.2 R113.2 R114.2 R115.2
N$131: R114.1 R116.1 R117.2
N$132: D49.C IC11.6(OUT) R118.1
N$133: C61.1 D50.A D51.C R118.2 R122.2 T15.G
N$134: D50.C R119.1
N$135: R120.1 R121.2
N$136: Q9.1(E) R102.1 R115.1 R123.1
N$137: D52.C R121.1 TR6.1
N$138: D52.A T15.A TR6.7
N$139: D58.A R140.2(S)
N$140: R124.2 R126.1(A)
N$141: D58.C Q11.2(C)
N$142: D53.C Q9.3(B) R125.1
N$143: D54.A R125.2
N$144: IC11.4(V-) IC12.4(V-) R132.1
N$145: R129.1 R131.1 R132.2
N$146: D55.A D56.C IC12.6(OUT)
N$147: D55.C IC12.2(-IN) R129.2 R130.2
N$148: IC13.3(+IN) R87.2
N$149: IC13.2(-IN) R133.2 R134.1
N$150: D57.A R135.2(S)
N$151: Q10.1(E) R139.2
N$152: IC12.3(+IN) R128.1
N$153: D56.A R91.1
N$154: C64.1 Q11.3(B) R142.2 R143.1
N$155: R135.1(A) R136.2
N$156: R140.1(A) R141.2
N$157: Q11.1(E) R144.2
N$158: R145.3(E) R146.1
N$159: R145.1(A) R148.1
N$160: R145.2(S) R147.2
N$161: C65.1 R149.1 R150.2
N$162: R160.3(E) R161.1
N$163: D59.A IC14.2(-IN) R147.1 R150.1
N$164: IC14.3(+IN) R151.1
N$165: D59.C D60.A IC14.6(OUT)
N$166: D60.C R152.1 R153.1
N$167: C66.1 R153.2 R154.1
N$168: IC15.11(D:O) IC16.1(A:I) IC16.5(C:I) IC18.2(A:I1)
N$169: IC16.2(A:O) IC16.3(B:I)
N$170: IC15.6(B:I1) R154.2
N$171: R160.1(A) R163.1
N$172: IC15.10(C:O) IC15.13(D:I1)
N$173: IC15.8(C:I0) IC15.9(C:I1) R158.2
N$174: C67.1 R155.2 R156.1 R157.2
N$175: D61.A IC15.4(B:O) R155.1
N$176: D61.C R157.1
N$177: IC15.3(A:O) R159.1
N$178: C68.1 R158.1 R159.2
N$179: IC15.2(A:I1) R156.2
N$180: R160.2(S) R162.2
N$181: C69.1 R164.1 R165.2
N$182: D62.A IC17.2(-IN) R162.1 R165.1
N$183: IC17.3(+IN) R166.1
N$184: D62.C D63.A IC17.6(OUT)
N$185: D63.C R167.1 R168.1
N$186: C70.1 R168.2 R169.1
N$187: IC18.12(D:I0) R175.2
N$188: IC19.2(A:O) IC19.3(B:I)
N$189: IC18.10(C:O) IC18.13(D:I1)
N$190: IC18.8(C:I0) IC18.9(C:I1) R173.2
N$191: C71.1 R170.2 R171.1 R172.2
N$192: D64.A IC18.4(B:O) R170.1
N$193: D64.C R172.1
N$194: IC18.3(A:O) R174.1
N$195: C72.1 R173.1 R174.2
N$196: IC18.5(B:I0) R169.2
N$197: IC18.1(A:I0) R171.2
N$198: D65.C R175.1 R176.2
N$199: IC15.5(B:I0) IC18.6(B:I1)
N$200: IC15.1(A:I0) IC18.11(D:O) IC19.1(A:I) IC19.5(C:I)
N$201: C73.1 D65.A R177.1
O: IC16.4(B:O) IC19.4(B:O)
PLN_NETRAL: TR1.4 TR2.4
PLN_PHASE: TR1.1 TR2.1
Unconnected: C71.2 IC3.1(ON1) IC3.5(ON2) IC3.8(OPT) IC4.1(ON1) IC4.5(ON2) IC4.8(OPT) IC5.1(ON1) IC5.5(ON2) IC5.8(OPT) IC6.1(ON1) IC6.5(ON2) IC6.8(OPT) IC7.1(ON1) IC7.5(ON2) IC7.8(OPT) IC8.1(ON1) IC8.5(ON2) IC8.8(OPT) IC9.1(ON1) IC9.5(ON2) IC9.8(OPT) IC10.1(ON1) IC10.5(ON2) IC10.8(OPT) IC11.1(ON1) IC11.5(ON2) IC11.8(OPT) IC12.1(ON1) IC12.5(ON2) IC12.8(OPT) IC13.1(ON1) IC13.5(ON2) IC13.8(OPT) IC14.1(ON1) IC14.5(ON2) IC14.8(OPT) IC16.8(D:O) IC16.9(D:I) IC16.10(E:O) IC16.11(E:I) IC16.12(F:O) IC16.13(F:I) IC17.1(ON1) IC17.5(ON2) IC17.8(OPT) IC19.8(D:O) IC19.9(D:I) IC19.10(E:O) IC19.11(E:I) IC19.12(F:O) IC19.13(F:I) T3.1(E) T5.1(E) T6.1(E) T8.1(E)

## Notes on the sheet
- POWER SUPPLY
- FORWARD GATE
- REVERSE GATE
- ISOLATION CIRCUIT | LOGIC CIRCUIT

## Power pins joined to a net without a drawn wire
V-: IC10.4(V-)
VDD: IC15.14(P:VDD) IC16.14(P:VDD) IC18.14(P:VDD) IC19.14(P:VDD)
VSS: IC15.7(P:VSS) IC16.7(P:VSS) IC18.7(P:VSS) IC19.7(P:VSS)

## Library data of the parts
2K/1W 2K/1W1-2K/1W12 R1-R6 R8 R10-R18 R20-R47 R49-R80 R82-R93 R95-R125 R127-R134 R136-R139 R141-R144 R146-R159 R161-R177 = rcl:R-EU_: RESISTOR, European symbol; SPICEPREFIX: R
C1-C4 C39 C47 = rcl:CPOL-EU: POLARIZED CAPACITOR, European symbol; SPICEPREFIX: C
C5-C38 C40-C46 C48-C73 = rcl:C-EU: CAPACITOR, European symbol; SPICEPREFIX: C
D1-D65 = diode:1N4004: DIODE general purpose rectifier, 1 A
IC1 IC2 = linear:78*: Positive VOLTAGE REGULATOR Source: http://cache.national.com/ds/LM/LM78L05.pdf http://www.fairchildsemi.com/ds/LM/LM7805.pdf
IC3-IC14 IC17 = linear:*741: OP AMP
IC15 IC18 = 40xx:4011: Quad 2-input NAND
IC16 IC19 = 40xx:4069: Hex INVERTER
Q1-Q11 = transistor-pnp:BD140: PNP Transistor
R7 R9 R19 R48 R81 R94 R126 R135 R140 R145 R160 = rcl:R-TRIMM: Trimm resistor; SPICEMODEL: X; SPICEPREFIXL: POT
T1-T11 = transistor:BD139: NPN TRANSISTOR
T12-T15 = triggered_devices:BT148: THYRISTOR
TR1 TR2 = trafo:CTX02-14659: Transformer, Push-Pull 300kHz, 547uH, ER 9.5, SMT, gull wing, 8 pads Source: COOPERE ELECTRONIC TECHNOLOGIES .. ctx02-14659.pdf
TR3-TR6 = trafo:EI54-2: TRANSFORMER 1 primary winding, 2 secondary windings ERA